# EAGLE design psu (EAGLE 9.6.2)
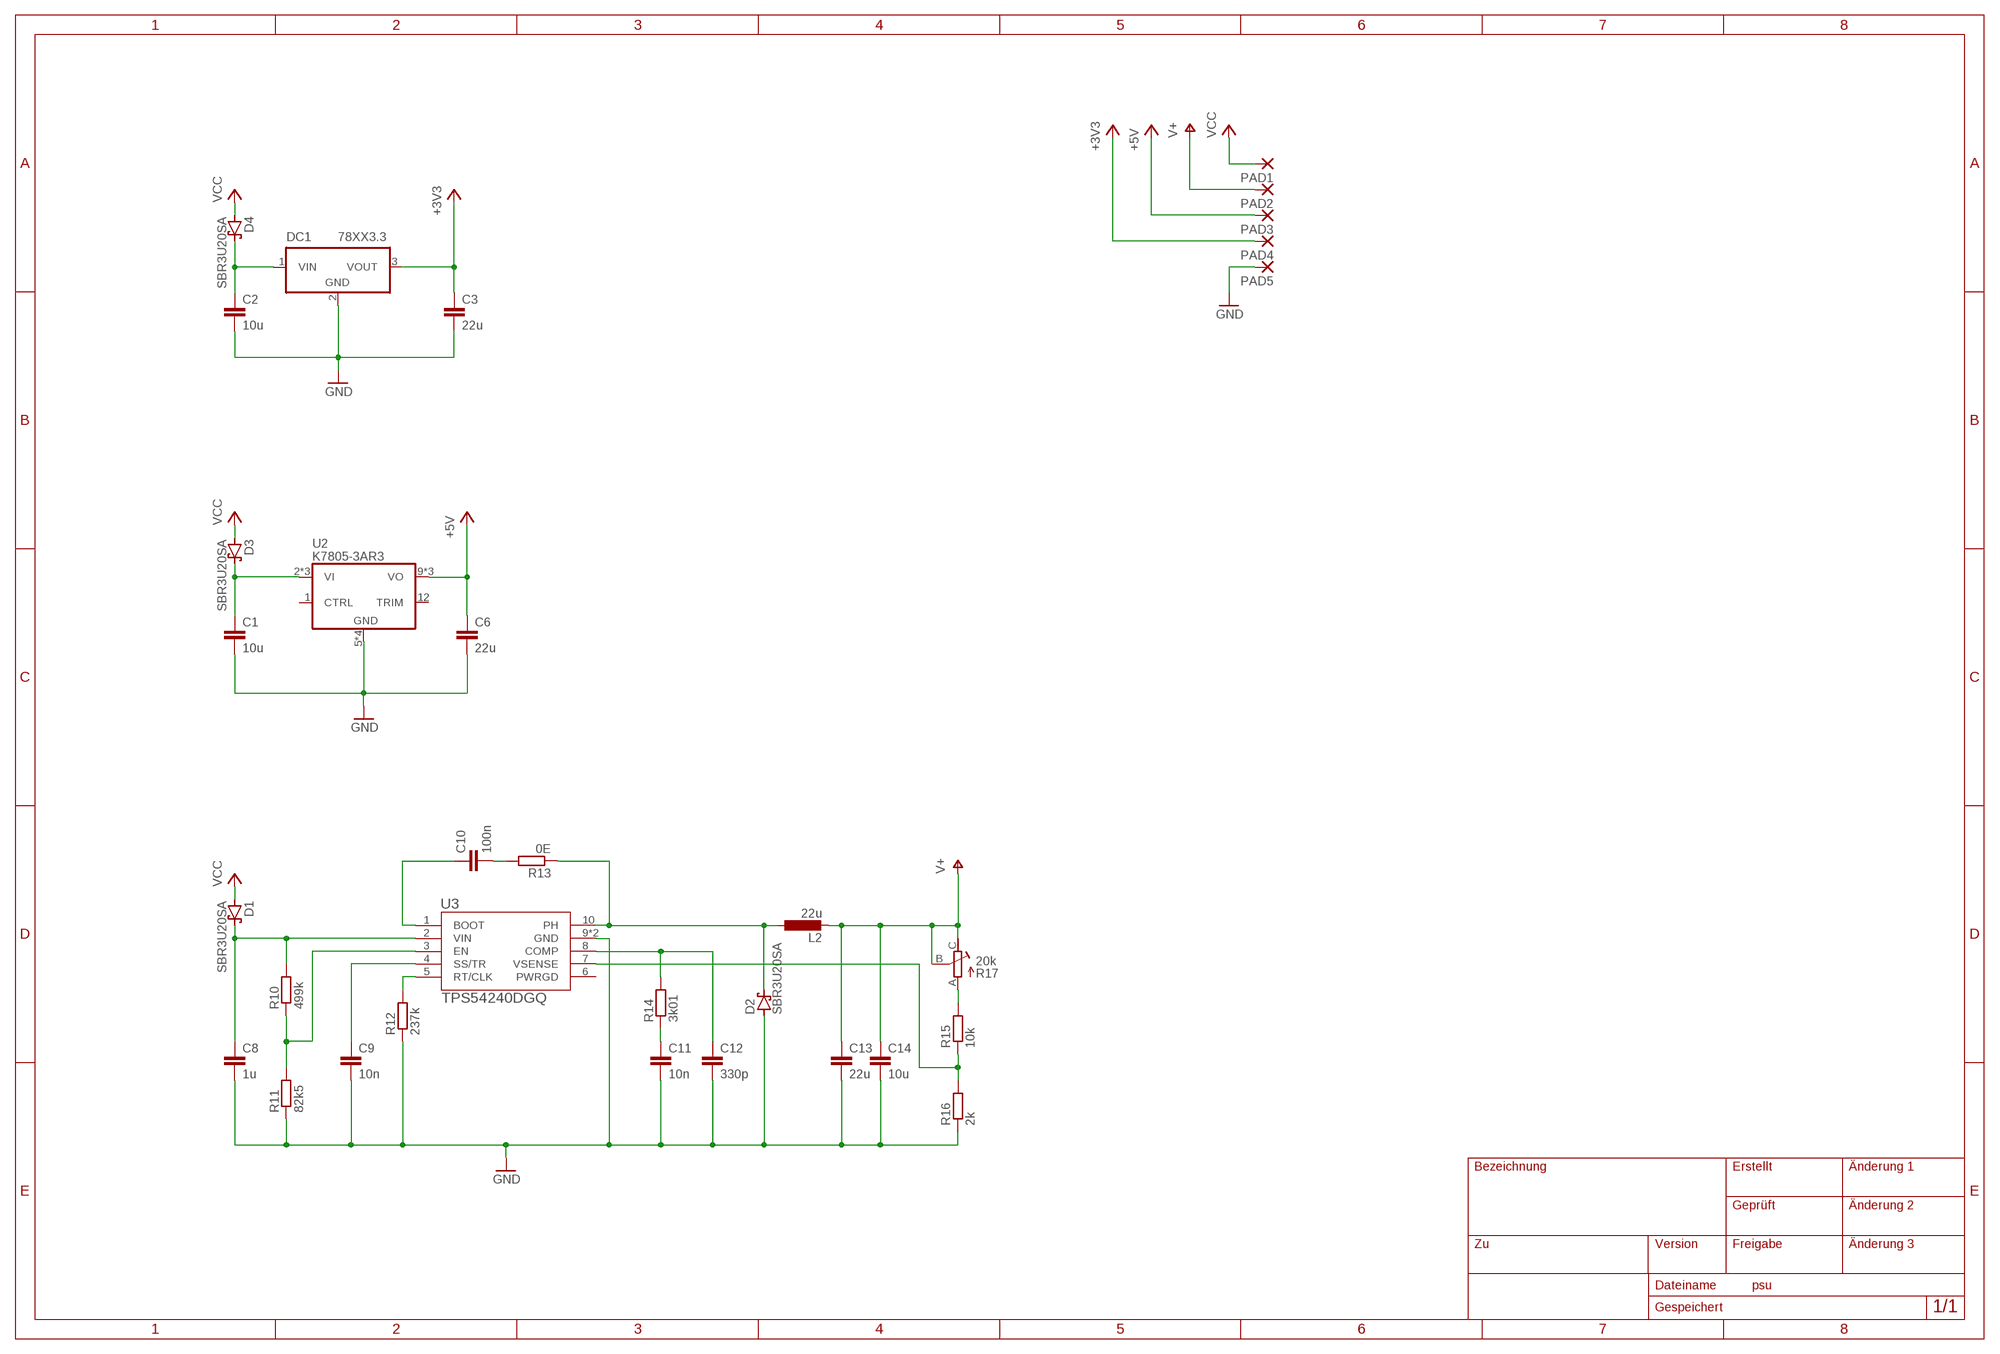
[diagram p0: schematic, sheet 1]

## Parts
C1  10u  C-EUC0805  [C0805]
C2  10u  C-EUC0805  [C0805]
C3  22u  C-EUC0805  [C0805]
C6  22u  C-EUC0805  [C0805]
C8  1u  C-EUC0805  [C0805]
C9  10n  C-EUC0603  [C0603]
C10  100n  C-EUC0603  [C0603]
C11  10n  C-EUC0603  [C0603]
C12  330p  C-EUC0603  [C0603]
C13  22u  C-EUC0805  [C0805]
C14  10u  C-EUC0603  [C0603]
D1  SBR3U20SA  DIODE-SCHOTTKY-SMA  [SMA]
D2  SBR3U20SA  DIODE-SCHOTTKY-SMA  [SMA]
D3  SBR3U20SA  DIODE-SCHOTTKY-SMA  [SMA]
D4  SBR3U20SA  DIODE-SCHOTTKY-SMA  [SMA]
DC1  78XX3.3  [SIP3]
L2  22u  SPULE11.7X11  [ETQP4M]
PAD1  WIREPAD2,54/1,1  [2,54/1,1]
PAD2  WIREPAD2,54/1,1  [2,54/1,1]
PAD3  WIREPAD2,54/1,1  [2,54/1,1]
PAD4  WIREPAD2,54/1,1  [2,54/1,1]
PAD5  WIREPAD2,54/1,1  [2,54/1,1]
R10  499k  R-EU_R0603  [R0603]
R11  82k5  R-EU_R0603  [R0603]
R12  237k  R-EU_R0603  [R0603]
R13  0E  R-EU_R0603  [R0603]
R14  3k01  R-EU_R0603  [R0603]
R15  10k  R-EU_R0603  [R0603]
R16  2k  R-EU_R0603  [R0603]
R17  20k  TRIMMER-TS53YL  [TS53YL]
U2  K7805-3AR3  K78XX-3AR3  [K78XX-3AR3]
U3  TPS54240DGQ  [HVSSOP-10P]

## Nets
+3V3: C3.1 DC1.3(VOUT) PAD4.1(P)
+5V: C6.1 PAD3.1(P) U2.9(VO) U2.10(VO) U2.11(VO)
GND: C1.2 C2.2 C3.2 C6.2 C8.2 C9.2 C11.2 C12.2 C13.2 C14.2 D2.A DC1.2(GND) PAD5.1(P) R11.1 R12.1 R16.1 U2.5(GND) U2.6(GND) U2.7(GND) U2.8(GND) U3.9(GND) U3.11(GND)
N$1: C8.1 D1.C R10.2 U3.2(VIN)
N$2: C1.1 D3.C U2.2(VI) U2.3(VI) U2.4(VI)
N$3: C2.1 D4.C DC1.1(VIN)
N$7: C11.1 R14.1
N$9: C10.1 U3.1(BOOT)
N$12: C10.2 R13.2
N$15: D2.C L2.1 R13.1 U3.10(PH)
N$16: R15.1 R16.2 U3.7(VSENSE)
N$17: R10.1 R11.2 U3.3(EN)
N$18: C9.1 U3.4(SS/TR)
N$19: R12.2 U3.5(RT/CLK)
N$20: C12.1 R14.2 U3.8(COMP)
N$21: R15.2 R17.A
V+: C13.1 C14.1 L2.2 PAD2.1(P) R17.B(S) R17.C(E)
VCC: D1.A D3.A D4.A PAD1.1(P)
Unconnected: U2.1(CTRL) U2.12(TRIM) U3.6(PWRGD)

## Library data of the parts
C1-C3 C6 C8-C14 = rcl:C-EU: CAPACITOR, European symbol; SPICEPREFIX: C
D1-D4 = Aktiv:DIODE-SCHOTTKY: Silicon Schottky Diodes General-purpose diode for high-speed switching; OC_DIGIKEY: SBR3U20SA-13DICT-ND
DC1 = Aktiv:78XX: Morsun DC/DC-Converter 0.5 AMP SIP3 Single Output Source: Data sheet <https://www.mornsun-power.com/html/pdf/K7803-500R3.html>; OC_DIGIKEY: 2725-K7803-500R3-ND
L2 = Passiv:SPULE: Spule; OC_DIGIKEY: P19783CT-ND
PAD1-PAD5 = wirepad:WIREPAD: Wire PAD connect wire on PCB
R10-R16 = rcl:R-EU_: RESISTOR, European symbol; SPICEPREFIX: R
R17 = Passiv:TRIMMER: Trimmer; OC_DIGIKEY: TS53YL-20KCT-ND
U2 = Aktiv:K78XX-3AR3: DC/DC-Converter K78xx-3AR3 series are high efficiency switching regulators. The converters feature high efficiency, low loss, short circuit protection, and there is no need for a heat sink. These products are widely used in applications such as industrial control, instrumentation and electric power.; OC_DIGIKEY: 2725-K7805-3AR3-ND
U3 = Aktiv:TPS54240; DATASHEET_URL: http://www.ti.com/lit/gpn/TPS54240; DESCRIPTION: 3.5V to 42V Input, 2.5A Step-Down Converter with Eco-Mode; FAMILY_NAME: STEP-DOWN REGULATOR; GENERIC_PART_NUMBER: TPS54240; INDUSTRY_STD_PKG_TYPE: MSOP-PowerPAD; MANUFACTURER: Texas Instruments; MANUFACTURER_PART_NUMBER: TPS54240DGQ; OC_DIGIKEY: 296-27414-1-ND; PACKAGE_DESIGNATOR: DGQ; PIN_COUNT: 10; VENDOR: Texas Instruments

## Board
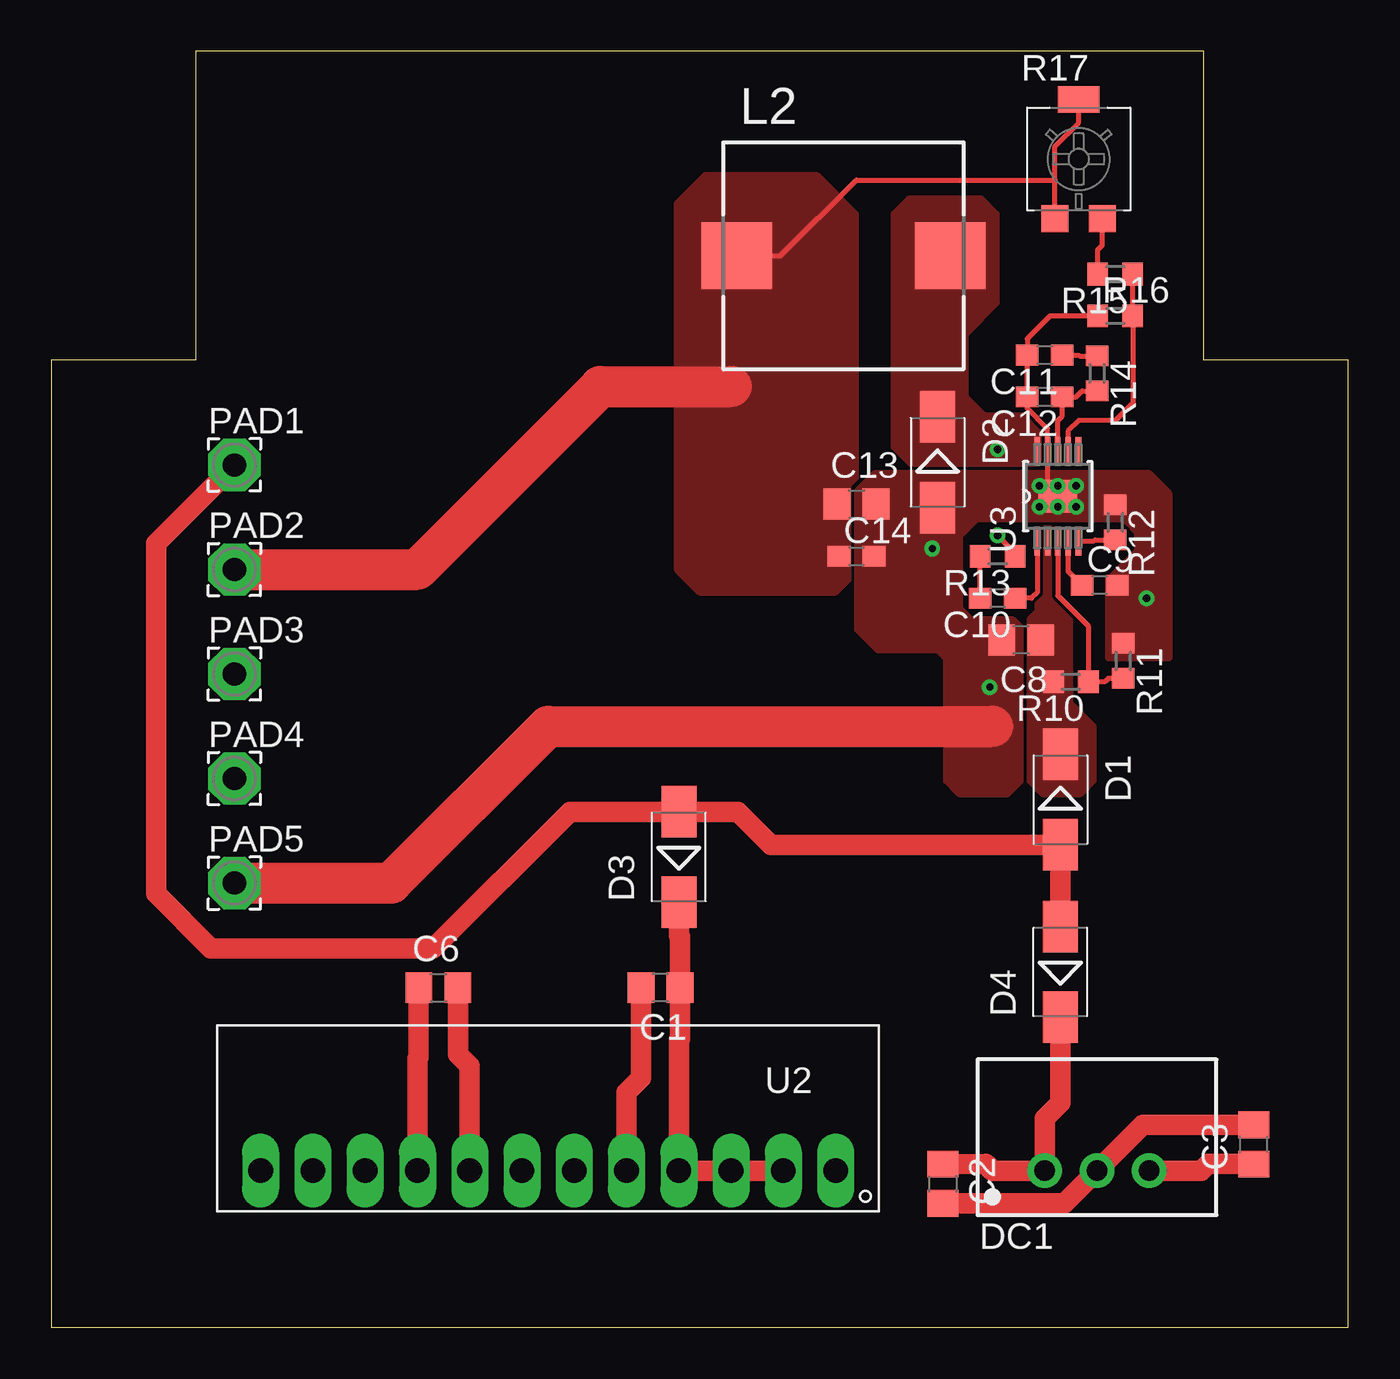
[diagram p1: board, top side]
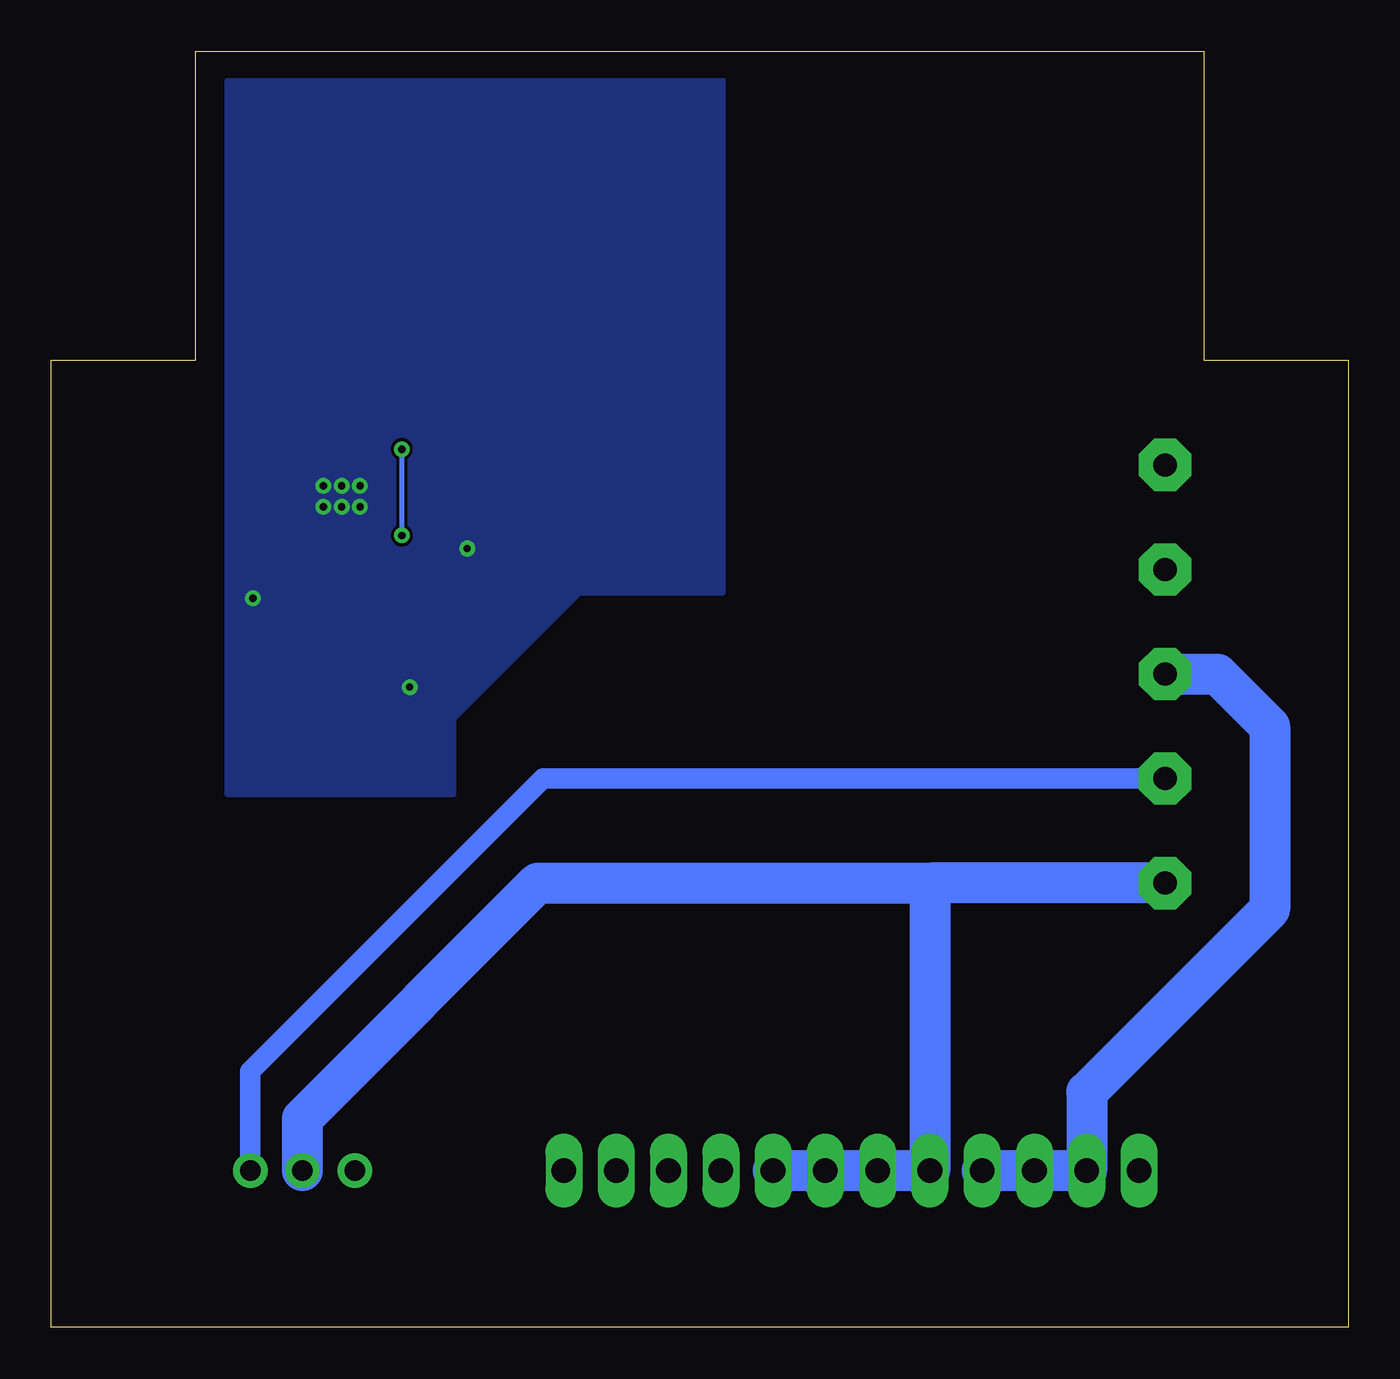
[diagram p2: board, bottom side, seen from below]

Size 63 x 62 mm. Coordinates in mm from the lower left corner, seen from the top.
Outline: 0,0 63,0 63,47 56,47 56,62 7,62 7,47 0,47 0,0
Copper layers (1*16): Top 0.035mm / dielectric 1.5mm / Bottom 0.035mm
Design rules "default": minimum track width 6mil, minimum drill 0.35mm, track to track 6mil, track to pad 6mil, pad to pad 6mil, via to via 6mil, smd to smd 6mil, copper to edge 40mil, drill to drill 6mil, minimum pad ring 10mil, minimum via ring 8mil, stop-mask expansion 4mil, vias tented up to drill 0mil, thermal gap 10mil

### Footprints (pad centres in the part's own frame; a part is rotated, then mirrored left to right if it is on the bottom)
C0805 = smd 1.3 x 1.5: 1 -0.95,0; 2 0.95,0
C0603 = smd 1.1 x 1: 1 -0.85,0; 2 0.85,0
SMA = smd 2.5 x 1.7: A 2.2,0; C -2.2,0
SIP3 = drill 1 pad 1.676: 1 -2.54,0; 2 0,0; 3 2.54,0
ETQP4M = smd 3.254 x 3.439: 1 0,5.187; 2 0,-5.187
2,54/1,1 = drill 1.118 pad 2.54 octagon: 1 0,0
R0603 = smd 1 x 1.1: 1 -0.85,0; 2 0.85,0
TS53YL = smd 1.3 x 1.3: A 1.15,-2.9; C -1.15,-2.9 | smd 2 x 1.3: B 0,2.9
K78XX-3AR3 = drill 1.2 long: 1 -13.97,2.54; 2 -11.43,2.54; 3 -8.89,2.54; 4 -6.35,2.54; 5 -3.81,2.54; 6 -1.27,2.54; 7 1.27,2.54; 8 3.81,2.54; 9 6.35,2.54; 10 8.89,2.54; 11 11.43,2.54; 12 13.97,2.54
HVSSOP-10P = smd 1.4 x 0.27: 1 -2.175,1; 2 -2.175,0.5; 3 -2.175,0; 4 -2.175,-0.5; 5 -2.175,-1; 6 2.175,-1; 7 2.175,-0.5; 8 2.175,0; 9 2.175,0.5; 10 2.175,1 | smd 1.57 x 1.88: 11 0,0

### Placement (x,y rotation side)
C1  29.59,16.51 180 top
C2  43.31,6.99 270 top
C3  58.42,8.89 90 top
C6  18.8,16.51 0 top
C8  47.12,33.4 180 top
C9  50.93,36.07 0 top
C10  45.97,35.43 180 top
C11  48.26,47.24 180 top
C12  48.26,45.21 180 top
C13  39.12,40.01 0 top
C14  39.12,37.47 0 top
D1  49.02,25.65 270 top
D2  43.05,42.04 270 top
D3  30.48,22.86 90 top
D4  49.02,17.27 90 top
DC1  50.8,7.62 0 top
L2  38.48,52.07 270 top
PAD1  8.89,41.91 0 top
PAD2  8.89,36.83 0 top
PAD3  8.89,31.75 0 top
PAD4  8.89,26.67 0 top
PAD5  8.89,21.59 0 top
R10  49.53,31.37 180 top
R11  52.07,32.38 270 top
R12  51.69,39.12 270 top
R13  45.97,37.47 180 top
R14  50.8,46.35 270 top
R15  51.69,51.18 180 top
R16  51.69,49.15 0 top
R17  49.91,56.77 0 top
U2  24.13,10.16 180 top
U3  48.9,40.39 90 top

### Tracks (layer width: path | path; a pad name or v marks a point on that pad's centre or on a via)
+3V3
  Top 1: DC1.3 55.88,7.62 56.2,7.94 C3.1
  Bottom 1: DC1.3 53.34,12.45 39.12,26.67 PAD4.1
+5V
  Top 1: U2.9 17.78,13.08 17.85,13.15 C6.1
  Bottom 2: PAD3.1 6.35,31.75 3.81,29.21 3.81,20.32 12.7,11.43 U2.11 U2.10 U2.9
GND  (via drill 0.35)
  Top 0.25: 48.4,41.03 U3.9 48.4,43.68 47.41,44.66 C12.2 C11.2 47.41,48.05 48.51,49.15 R16.1
  Top 1: C6.2 19.75,13.27 20.32,12.7 U2.8 | U2.5 27.94,11.43 28.64,12.13 C1.2 | C2.2 49.22,6.04 DC1.2 53.02,9.84 C3.2
  Top 2: PAD5.1 16.51,21.59 24.13,29.21 45.72,29.21
  Bottom 2: PAD5.1 20.32,21.59 | 20.32,21.59 U2.8 U2.7 U2.6 U2.5 | DC1.2 50.8,10.16 39.37,21.59 20.32,21.59
  other vias: 48.9,39.88 48.9,40.89 48.01,40.89 48.01,39.88 49.78,39.88 49.78,40.89 45.59,31.11 42.8,37.85 53.21,35.43
  pour Top (no thermals): 44.07,25.91 46.48,25.91 47.12,26.54 47.12,34.04 46.74,34.42 44.7,34.42 44.2,34.92 44.2,38.48 44.96,39.24 52.07,39.24 52.7,38.61 52.7,37.72 51.31,36.32 51.31,32.51 54.36,32.51 54.36,40.51 53.34,41.53 40.01,41.53 39.12,40.64 39.12,33.91 40.13,32.89 43.05,32.89 43.43,32.51 43.43,26.54
  pour Bottom (rank 2, no thermals): 54.48,25.91 43.43,25.91 43.43,29.59 37.34,35.69 30.35,35.69 30.35,60.58 54.48,60.58
N$1
  pour Top (rank 2, no thermals): 50.67,26.54 50.67,29.21 49.53,30.35 49.53,34.42 48.9,35.05 48.9,38.99 48.64,39.24 48.13,39.24 47.88,38.99 47.88,34.8 47.5,34.42 47.5,26.54 48.13,25.91 50.04,25.91
N$2
  Top 1: U2.2 U2.3 U2.4 30.48,13.97 30.54,14.03 C1.1 30.54,18.99 30.48,19.05 D3.C
N$3
  Top 1: C2.1 45.4,7.94 45.72,7.62 DC1.1 48.26,10.16 49.02,10.92 D4.C
N$7
  Top 0.25: C11.1 49.91,47.24 49.95,47.2 R14.1
N$9
  Top 0.25: U3.1 47.9,35.7 47.62,35.43 C10.1
N$12
  Top 0.25: C10.2 R13.2
N$15  (via drill 0.35)
  Top 0.25: R13.1 46.82,37.63 v45.97,38.48
  Bottom 0.25: v45.97,38.48 v45.97,42.67
  pour Top (rank 2, no thermals): 48.13,42.29 48.13,43.43 47.24,44.32 45.34,44.32 44.45,45.21 44.45,48.26 45.97,49.78 45.97,54.1 45.21,54.86 41.66,54.86 40.89,54.1 40.89,42.8 41.91,41.78 47.62,41.78
N$16
  Top 0.25: R15.1 R16.2 52.54,44.92 51.69,44.07 49.91,44.07 49.4,43.55 U3.7
N$17
  Top 0.25: R11.2 51.35,31.54 51.18,31.37 R10.1 50.38,34.08 48.9,35.56 U3.3
N$18
  Top 0.25: U3.4 49.4,36.75 C9.1
N$19
  Top 0.25: U3.5 50.66,38.21 50.71,38.27 R12.2
N$20
  Top 0.25: U3.8 48.9,44.07 49.11,44.28 C12.1 49.78,45.21 50.08,45.51 R14.2
N$21
  Top 0.25: R15.2 50.84,52.36 51.06,52.59 R17.A
V+
  Top 0.25: R17.C 48.76,55.75 | 48.76,55.75 48.76,57.4 49.91,58.55 R17.B | L2.2 35.43,52.07 39.12,55.75 48.76,55.75
  Top 2: PAD2.1 17.78,36.83 26.67,45.72 33.02,45.72
  pour Top (rank 2, no thermals): 39.12,36.7 39.12,54.1 37.21,56.01 31.75,56.01 30.35,54.61 30.35,36.83 31.5,35.69 38.1,35.69
VCC
  Top 1: D4.A D1.A 34.97,23.45 33.36,25.06 D3.A 25.19,25.06 18.54,18.41 7.75,18.41 5.08,21.08 5.08,38.1 PAD1.1